# EAGLE design 2te4In_ak_01_SNT (EAGLE 5.00)
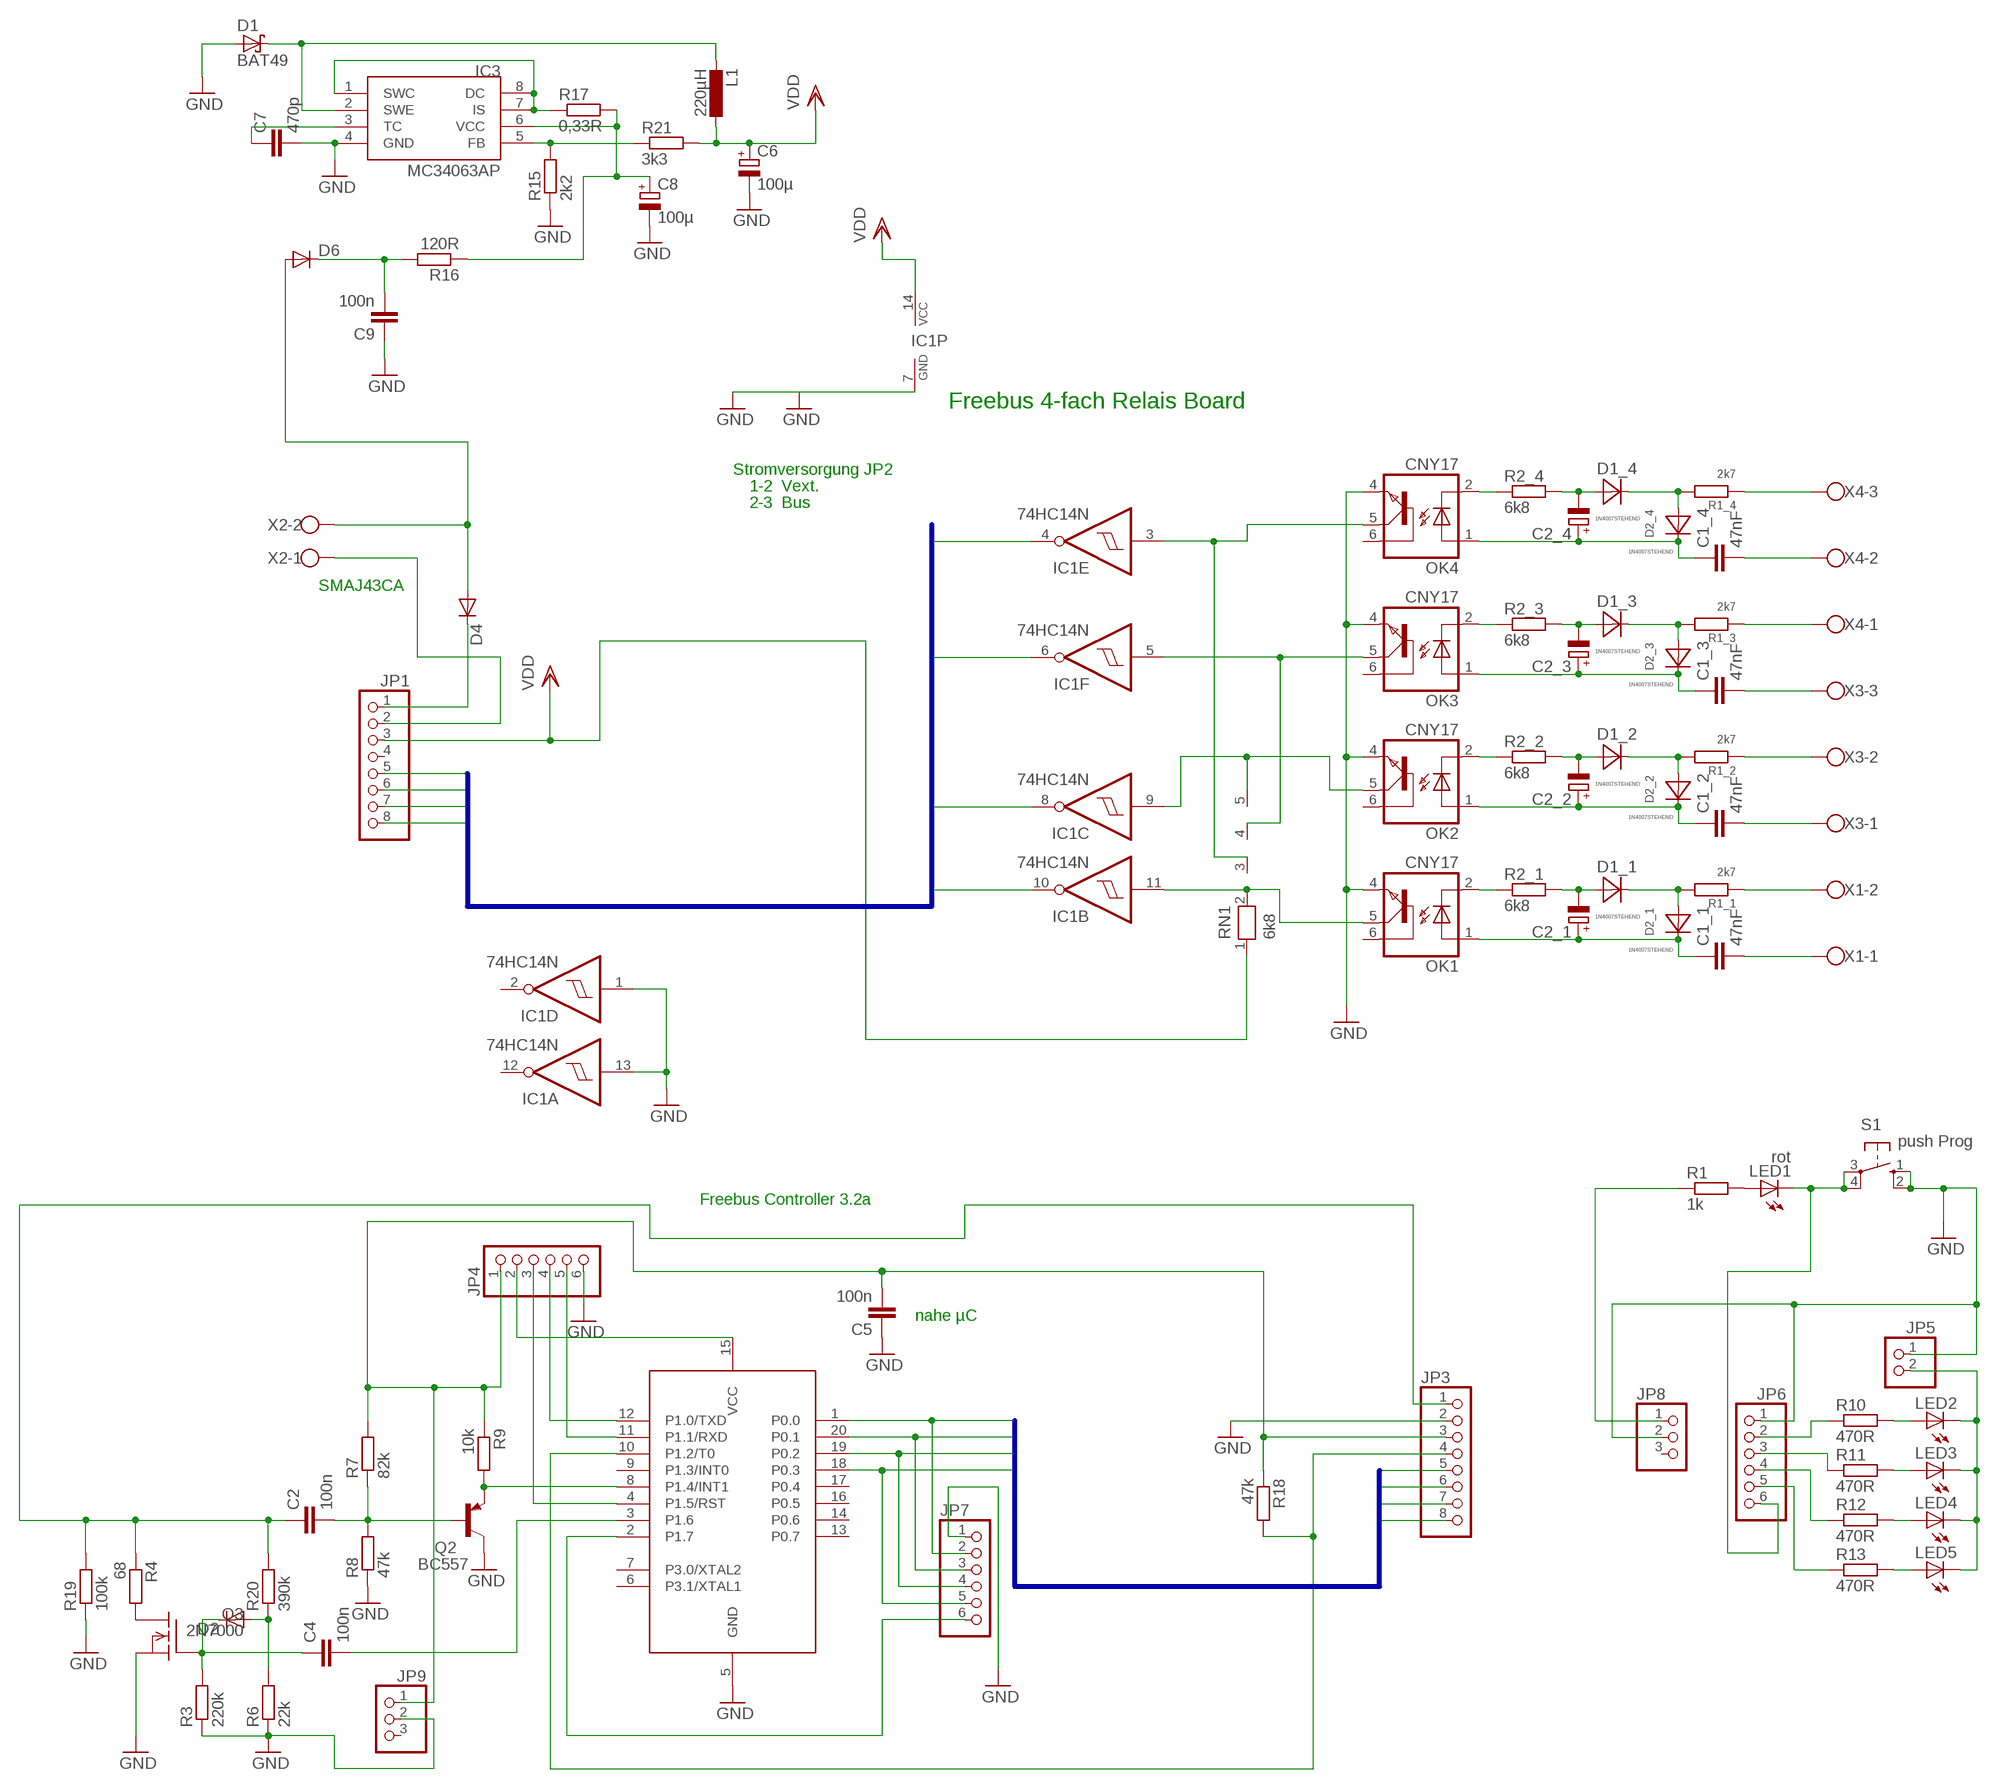
[diagram p0: schematic, sheet 1]

## Parts
C1_1  47nF  C-EU075-063X106  [C075-063X106]
C1_2  47nF  C-EU075-063X106  [C075-063X106]
C1_3  47nF  C-EU075-063X106  [C075-063X106]
C1_4  47nF  C-EU075-063X106  [C075-063X106]
C2  100n  C-EU050-024X044  [C050-024X044]
C2_1  CPOL-EUE2-4  [E2-4]
C2_2  CPOL-EUE2-4  [E2-4]
C2_3  CPOL-EUE2-4  [E2-4]
C2_4  CPOL-EUE2-4  [E2-4]
C4  100n  C-EU050-024X044  [C050-024X044]
C5  100n  C-EU050-024X044  [C050-024X044]
C6  100µ  CPOL-EUE5-8.5  [E5-8,5]
C7  470p  C-EU025-024X044  [C025-024X044]
C8  100µ  CPOL-EUE5-8.5  [E5-8,5]
C9  100n  C-EU050-024X044  [C050-024X044]
D1  BAT49  [DO41-10]
D1_1  1N4007STEHEND  [RAD2,5]
D1_2  1N4007STEHEND  [RAD2,5]
D1_3  1N4007STEHEND  [RAD2,5]
D1_4  1N4007STEHEND  [RAD2,5]
D2  1N41481N4148S  [D-2.5]
D2_1  1N4007STEHEND  [RAD2,5]
D2_2  1N4007STEHEND  [RAD2,5]
D2_3  1N4007STEHEND  [RAD2,5]
D2_4  1N4007STEHEND  [RAD2,5]
D4  1N41481N4148S  [D-2.5]
D6  1N41481N4148S  [D-2.5]
IC1  74HC14N  [DIL14]
IC3  MC34063AP  [DIL08]
JP1  PINHD-1X8  [1X08]
JP3  PINHD-1X8  [1X08]
JP4  PINHD-1X6  [1X06]
JP5  PINHD-1X2  [1X02]
JP6  PINHD-1X6  [1X06]
JP7  PINHD-1X6  [1X06]
JP8  PINHD-1X3  [1X03]
JP9  PINHD-1X3  [1X03]
L1  220µH  L-EU0207/5V  [0207/5V]
LED1  rot  LED3MM  [LED3MM]
LED2  LED3MM  [LED3MM]
LED3  LED3MM  [LED3MM]
LED4  LED3MM  [LED3MM]
LED5  LED3MM  [LED3MM]
OK1  CNY17  [DIL06]
OK2  CNY17  [DIL06]
OK3  CNY17  [DIL06]
OK4  CNY17  [DIL06]
Q2  BC557  [TO92]
Q3  2N7000  VN2222KM  [TO237]
R1  1k  R-EU_0207/10  [0207/10]
R1_1  2k7  R-EU_0207/2V  [0207/2V]
R1_2  2k7  R-EU_0207/2V  [0207/2V]
R1_3  2k7  R-EU_0207/2V  [0207/2V]
R1_4  2k7  R-EU_0207/2V  [0207/2V]
R2_1  6k8  R-EU_0207/2V  [0207/2V]
R2_2  6k8  R-EU_0207/2V  [0207/2V]
R2_3  6k8  R-EU_0207/2V  [0207/2V]
R2_4  6k8  R-EU_0207/2V  [0207/2V]
R3  220k  R-EU_0204/7  [0204/7]
R4  68  R-EU_0207/10  [0207/10]
R6  22k  R-EU_0207/10  [0207/10]
R7  82k  R-EU_0207/10  [0207/10]
R8  47k  R-EU_0207/10  [0207/10]
R9  10k  R-EU_0207/10  [0207/10]
R10  470R  R-EU_0207/10  [0207/10]
R11  470R  R-EU_0207/10  [0207/10]
R12  470R  R-EU_0207/10  [0207/10]
R13  470R  R-EU_0207/10  [0207/10]
R15  2k2  R-EU_0207/2V  [0207/2V]
R16  120R  R-EU_0207/2V  [0207/2V]
R17  0,33R  R-EU_0207/2V  [0207/2V]
R18  47k  R-EU_0207/10  [0207/10]
R19  100k  R-EU_0207/10  [0207/10]
R20  390k  R-EU_0207/10  [0207/10]
R21  3k3  R-EU_0207/2V  [0207/2V]
RN1  6k8  RN04  [RN-5]
S1  push Prog  10-XX  [B3F-10XX]
U1  89LPC922  [DIL20]
X1  W237-02P  [W237-132]
X2  W237-02P  [W237-132]
X3  W237-3E  [W237-3E]
X4  W237-3E  [W237-3E]

## Nets
230+_1: C1_1.1 C2_1.+ D2_1.C OK1.1(A)
230+_2: C1_2.1 C2_2.+ D2_2.C OK2.1(A)
230+_3: C1_3.1 C2_3.+ D2_3.C OK3.1(A)
230+_4: C1_4.1 C2_4.+ D2_4.C OK4.1(A)
230-_1: C2_1.- D1_1.A R2_1.2
230-_2: C2_2.- D1_2.A R2_2.2
230-_3: C2_3.- D1_3.A R2_3.2
230-_4: C2_4.- D1_4.A R2_4.2
230N_1: D1_1.C D2_1.A R1_1.2
230N_2: D1_2.C D2_2.A R1_2.2
230N_3: D1_3.C D2_3.A R1_3.2
230N_4: D1_4.C D2_4.A R1_4.2
GND: C5.1 C6.- C7.2 C8.- C9.1 D1.A IC1.1(D:I) IC1.7(P:GND) IC1.13(A:I) IC3.4(GND) JP1.2 JP3.2 JP4.6 JP5.1 JP6.1 JP7.1 JP8.2 JP9.2 OK1.4(EMI) OK2.4(EMI) OK3.4(EMI) OK4.4(EMI) Q2.3(C) Q3.3(S) R3.1 R6.1 R8.1 R15.1 R19.1 S1.1(S) S1.2(S1) U1.5(GND) X2.1
IO1: IC1.10(B:O) JP1.5
IO2: IC1.8(C:O) JP1.8
IO3: IC1.6(F:O) JP1.7
IO4: IC1.4(E:O) JP1.6
N$1: C1_1.2 X1.1
N$2: R1_1.1 X1.2
N$3: Q2.1(E) R9.2 U1.8(P1.4/INT1)
N$4: D4.A D6.A X2.2
N$5: C1_2.2 X3.1
N$6: R1_2.1 X3.2
N$7: C1_3.2 X3.3
N$8: R1_3.1 X4.1
N$9: C1_4.2 X4.2
N$10: R1_4.1 X4.3
N$11: LED2.A R10.2
N$12: LED3.A R11.2
N$13: C2.2 Q2.2(B) R7.1 R8.2
N$14: C4.2 U1.3(P1.6)
N$15: Q3.1(D) R4.2
N$16: IC3.5(FB) R15.2 R21.1
N$17: IC1.11(B:I) OK1.5(COL) RN1.2
N$18: C2.1 JP3.1 R4.1 R19.2 R20.2
N$19: IC1.9(C:I) OK2.5(COL) RN1.5
N$20: JP5.2 LED2.K(C) LED3.K(C) LED4.K(C) LED5.K(C)
N$21: C5.2 JP3.3 JP4.1 JP9.1 R7.2 R9.1 R18.1
N$22: JP6.6 LED1.K(C) S1.3(P) S1.4(P1)
N$23: LED4.A R12.2
N$24: LED5.A R13.2
N$25: JP4.3 U1.4(P1.5/RST)
N$26: JP4.2 U1.15(VCC)
N$27: C4.1 D2.C Q3.2(G) R3.2
N$28: LED1.A R1.2
N$29: JP4.4 U1.12(P1.0/TXD)
N$30: JP4.5 U1.11(P1.1/RXD)
N$31: IC1.5(F:I) OK3.5(COL) RN1.4
N$34: JP6.2 R10.1
N$35: JP6.3 R11.1
N$36: JP6.4 R12.1
N$37: IC1.3(E:I) OK4.5(COL) RN1.3
N$38: JP6.5 R13.1
N$39: JP8.1 R1.1
N$40: D4.C JP1.1
N$43: JP3.4 R18.2 U1.10(P1.2/T0)
N$44: D2.A R6.2 R20.1
N$45: IC3.1(SWC) IC3.7(IS) IC3.8(DC) R17.1
N$46: D1.C IC3.2(SWE) L1.2
N$47: C7.1 IC3.3(TC)
N$49: C9.2 D6.C R16.2
N$50: C8.+ IC3.6(VCC) R16.1 R17.2
OPT_1: OK1.2(C) R2_1.1
OPT_2: OK2.2(C) R2_2.1
OPT_3: OK3.2(C) R2_3.1
OPT_4: OK4.2(C) R2_4.1
P0.0: JP3.5 JP7.2 U1.1(P0.0)
P0.1: JP3.8 JP7.3 U1.20(P0.1)
P0.2: JP3.7 JP7.4 U1.19(P0.2)
P0.3: JP3.6 JP7.5 U1.18(P0.3)
PGM: JP7.6 U1.2(P1.7)
VDD: C6.+ IC1.14(P:VCC) JP1.3 L1.1 R21.2 RN1.1
Unconnected: IC1.2(D:O) IC1.12(A:O) JP1.4 JP8.3 JP9.3 OK1.6(BAS) OK2.6(BAS) OK3.6(BAS) OK4.6(BAS) U1.6(P3.1/XTAL1) U1.7(P3.0/XTAL2) U1.9(P1.3/INT0) U1.13(P0.7) U1.14(P0.6) U1.16(P0.5) U1.17(P0.4)

## Buses
IO[1..8]
P0.[0..7]

## Notes on the sheet
- Freebus 4-fach Relais Board
- Stromversorgung JP2
- 1-2  Vext.
- 2-3  Bus
- SMAJ43CA
- Freebus Controller 3.2a
- nahe µC

## Library data of the parts
C1_1-C1_4 C2 C4 C5 C7 C9 = rcl:C-EU: CAPACITOR, European symbol
C2_1-C2_4 C6 C8 = rcl:CPOL-EU: POLARIZED CAPACITOR, European symbol
D1 = diode:BAT49: DIODE small signal diode
D1_1-D1_4 D2_1-D2_4 = diode:1N4007
D2 D4 D6 = diode:1N4148: DIODE high speed (Philips)
IC1 = 74xx-eu:74*14: Hex schmitt trigger INVERTER
IC3 = mc34063:MC34063
JP1 JP3 = pinhead:PINHD-1X8: PIN HEADER
JP4 JP6 JP7 = pinhead:PINHD-1X6: PIN HEADER
JP5 = pinhead:PINHD-1X2: PIN HEADER
JP8 JP9 = pinhead:PINHD-1X3: PIN HEADER
L1 = rcl:L-EU: INDUCTOR, European symbol
LED1-LED5 = led:LED: LED OSRAM: - CHIPLED LG R971, LG N971, LY N971, LG Q971, LY Q971, LO R971, LY R971 LH N974, LH R974 LS Q976, LO Q976, LY Q976 LO Q996 - Hyper CHIPLED LW Q18S LB Q993, LB Q99A, LB R99A - SideLED LS A670, LO A670, LY A670, LG A670, LP A670 LB A673, LV A673, LT A673, LW A673 LH A674 LY A675 LS A676, LA A676, LO A676, LY A676, LW A676 LS A679, LY A679, LG A679 - Hyper Micro SIDELED® LS Y876, LA Y876, LO Y876, LY Y876 LT Y87S - SmartLED LW L88C, LW L88S LB L89C, LB L89S, LG L890 LS L89K, LO L89K, LY L89K LS L896, LA L896, LO L896, LY L896 - TOPLED LS T670, LO T670, LY T670, LG T670, LP T670 LSG T670, LSP T670, LSY T670, LOP T670, LYG T670 LG T671, LOG T671, LSG T671 LB T673, LV T673, LT T673, LW T673 LH T674 LS T676, LA T676, LO T676, LY T676, LB T676, LH T676, LSB T676, LW T676 LB T67C, LV T67C, LT T67C, LS T67K, LO T67K, LY T67K, LW E67C LS E67B, LA E67B, LO E67B, LY E67B, LB E67C, LV E67C, LT E67C LW T67C LS T679, LY T679, LG T679 LS T770, LO T770, LY T770, LG T770, LP T770 LB T773, LV T773, LT T773, LW T773 LH T774 LS E675, LA E675, LY E675, LS T675 LS T776, LA T776, LO T776, LY T776, LB T776 LHGB T686 LT T68C, LB T68C - Hyper Mini TOPLED® LB M676 - Mini TOPLED Santana® LG M470 LS M47K, LO M47K, LY M47K Source: http://www.osram.convergy.de - LUMILED® LXK2-PW12-R00, LXK2-PW12-S00, LXK2-PW14-U00, LXK2-PW14-V00 LXK2-PM12-R00, LXK2-PM12-S00, LXK2-PM14-U00 LXK2-PE12-Q00, LXK2-PE12-R00, LXK2-PE12-S00, LXK2-PE14-T00, LXK2-PE14-U00 LXK2-PB12-K00, LXK2-PB12-L00, LXK2-PB12-M00, LXK2-PB14-N00, LXK2-PB14-P00, LXK2-PB14-Q00 LXK2-PR12-L00, LXK2-PR12-M00, LXK2-PR14-Q00, LXK2-PR14-R00 LXK2-PD12-Q00, LXK2-PD12-R00, LXK2-PD12-S00 LXK2-PH12-R00, LXK2-PH12-S00 LXK2-PL12-P00, LXK2-PL12-Q00, LXK2-PL12-R00 Source: www.luxeon.com
OK1-OK4 = optocoupler:CNY17: SIEMENS OPTO COUPLER
Q2 = transistor-pnp:BC557: PNP Transistor
Q3 = transistor-fet:VN2222KM: N-Channel Enhancement MOSFET (VMOS); 60V; 0,5A; 7,5Ohm
R1 R1_1-R1_4 R2_1-R2_4 R3 R4 R6-R13 R15-R21 = rcl:R-EU_: RESISTOR, European symbol
RN1 = resistor-net:RN04: RESISTOR NETWORK
S1 = switch-omron:10-XX: OMRON SWITCH
U1 = micro-philips:89LPC922
X1 X2 = con-wago-508:W237-02P: WAGO SREW CLAMP
X3 X4 = con-wago-508:W237-3E: WAGO SREW CLAMP

## Board
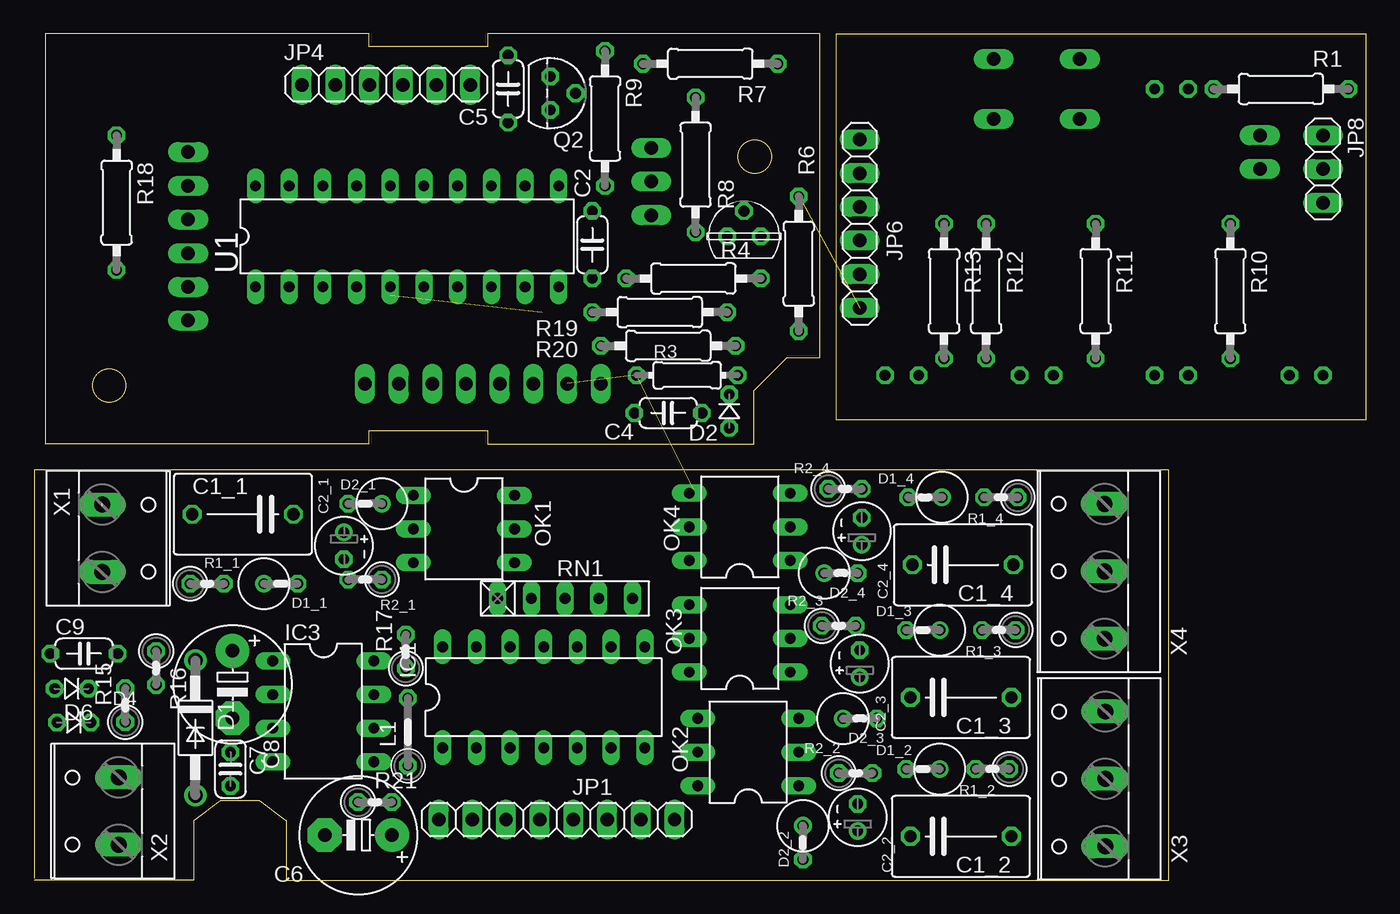
[diagram p1: board, top side]
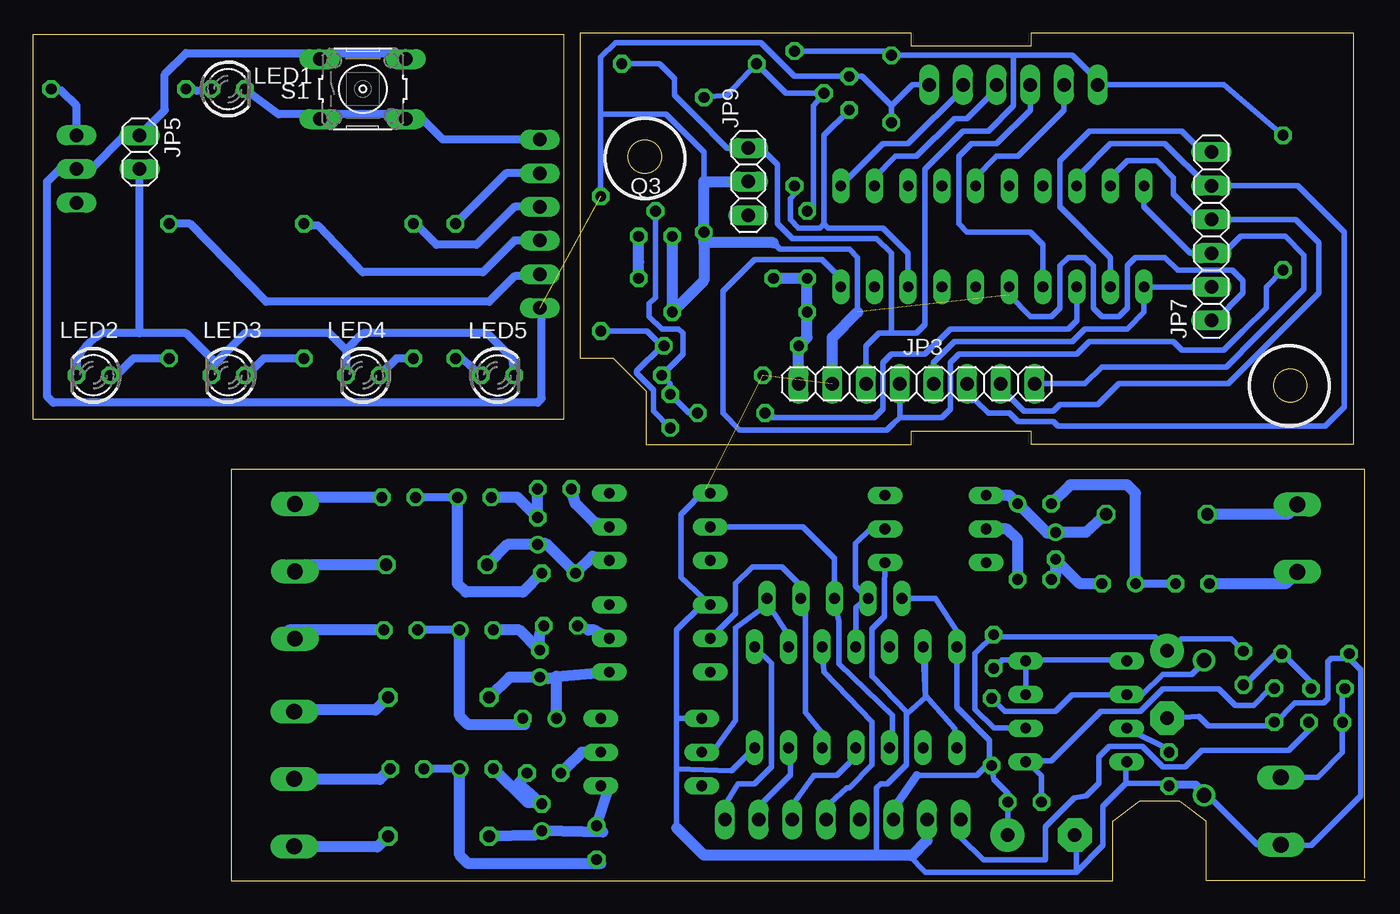
[diagram p2: board, bottom side, seen from below]

Size 100.42 x 63.9 mm. Coordinates in mm from the lower left corner, seen from the top.
Outline: 0.01,0.16 0.01,31 85.5,31 85.5,0 19,0 19,4.5 18.99,4.51 16.99,6.01 14.01,6.01 14.01,6 12,4.49 12,0 0,0
Outline: 59.2,39.4 56.7,39.4 54.2,36.9
Outline: 54.2,36.9 54.2,32.9 34.2,32.9 34.2,33.9
Outline: 34.2,33.9 25.2,33.9 25.2,32.9 0.83,32.9 0.83,63.9 25.2,63.9 25.2,62.9 34.2,62.9 34.2,63.9
Outline: 34.2,63.9 59.2,63.9 59.2,39.4
Outline: 100.42,34.78 100.42,63.82
Outline: 100.42,63.83 60.42,63.83
Outline: 60.42,63.82 60.42,34.78
Outline: 60.42,34.78 100.42,34.78
Outline: circle at 54.32,54.58 radius 1.26
Outline: circle at 5.65,37.32 radius 1.26
Copper layers (1*16): Top 0.035mm / dielectric 1.5mm / Bottom 0.035mm
Design rules "default": minimum track width 10mil, minimum drill 24mil, track to track 8mil, track to pad 8mil, pad to pad 8mil, via to via 8mil, smd to smd 8mil, copper to edge 40mil, drill to drill 8mil, minimum pad ring 10mil, minimum via ring 8mil, stop-mask expansion 4mil, vias tented up to drill 0mil, thermal gap 10mil

### Footprints (pad centres in the part's own frame; a part is rotated, then mirrored left to right if it is on the bottom)
C075-063X106 = drill 0.914 octagon: 1 -3.81,0; 2 3.81,0
C050-024X044 = drill 0.813 octagon: 1 -2.54,0; 2 2.54,0
E2-4 = drill 0.813 pad 1.27 round: + -1.016,0 | drill 0.813 pad 1.27 octagon: - 1.016,0
E5-8,5 = drill 1.016 pad 2.54 round: + -2.54,0 | drill 1.016 pad 2.54 octagon: - 2.54,0
C025-024X044 = drill 0.813 octagon: 1 -1.27,0; 2 1.27,0
DO41-10 = drill 1.118 round: A 5.08,0; C -5.08,0
RAD2,5 = drill 0.813 octagon: A 1.27,0 | drill 0.813 round: C -1.27,0
D-2.5 = drill 0.813 octagon: A 1.27,0; C -1.27,0
DIL14 = drill 0.813 long: 1 -7.62,-3.81; 2 -5.08,-3.81; 3 -2.54,-3.81; 4 0,-3.81; 5 2.54,-3.81; 6 5.08,-3.81; 7 7.62,-3.81; 8 7.62,3.81; 9 5.08,3.81; 10 2.54,3.81; 11 0,3.81; 12 -2.54,3.81; 13 -5.08,3.81; 14 -7.62,3.81
DIL08 = drill 0.813 long: 1 -3.81,-3.81; 2 -1.27,-3.81; 3 1.27,-3.81; 4 3.81,-3.81; 5 3.81,3.81; 6 1.27,3.81; 7 -1.27,3.81; 8 -3.81,3.81
1X08 = drill 1.016 long: 1 -8.89,0; 2 -6.35,0; 3 -3.81,0; 4 -1.27,0; 5 1.27,0; 6 3.81,0; 7 6.35,0; 8 8.89,0
1X06 = drill 1.016 long: 1 -6.35,0; 2 -3.81,0; 3 -1.27,0; 4 1.27,0; 5 3.81,0; 6 6.35,0
1X02 = drill 1.016 long: 1 -1.27,0; 2 1.27,0
1X03 = drill 1.016 long: 1 -2.54,0; 2 0,0; 3 2.54,0
0207/5V = drill 0.813 octagon: 1 -2.54,0; 2 2.54,0
LED3MM = drill 0.813 octagon: A -1.27,0; K 1.27,0
DIL06 = drill 0.813 long: 1 -2.54,-3.81; 2 0,-3.81; 3 2.54,-3.81; 4 2.54,3.81; 5 0,3.81; 6 -2.54,3.81
TO92 = drill 0.813 octagon: 1 1.27,0; 2 0,1.905; 3 -1.27,0
TO237 = drill 0.813 octagon: 1 1.27,0; 2 0,1.905; 3 -1.27,0
0207/10 = drill 0.813 octagon: 1 -5.08,0; 2 5.08,0
0207/2V = drill 0.813 octagon: 1 -1.27,0; 2 1.27,0
0204/7 = drill 0.813 octagon: 1 -3.81,0; 2 3.81,0
RN-5 = drill 0.813 long: 1 -5.08,0; 2 -2.54,0; 3 0,0; 4 2.54,0; 5 5.08,0
B3F-10XX = drill 1.016 long: 1 -3.251,2.261; 2 3.251,2.261; 3 -3.251,-2.261; 4 3.251,-2.261
DIL20 = drill 0.813 long: 1 -11.43,-3.81; 2 -8.89,-3.81; 3 -6.35,-3.81; 4 -3.81,-3.81; 5 -1.27,-3.81; 6 1.27,-3.81; 7 3.81,-3.81; 8 6.35,-3.81; 9 8.89,-3.81; 10 11.43,-3.81; 11 11.43,3.81; 12 8.89,3.81; 13 6.35,3.81; 14 3.81,3.81; 15 1.27,3.81; 16 -1.27,3.81; 17 -3.81,3.81; 18 -6.35,3.81; 19 -8.89,3.81; 20 -11.43,3.81
W237-132 = drill 1.194 long: 1 -2.54,-0.635; 2 2.54,-0.635
W237-3E = drill 1.194 long: 1 -5.08,-0.635; 2 0,-0.635; 3 5.08,-0.635

### Placement (x,y rotation side)
C1_1  15.72,27.62 180 top
C1_2  69.85,3.34 0 top
C1_3  69.85,13.81 0 top
C1_4  70.01,23.81 0 top
C2  42.07,47.94 90 top
C2_1  23.34,25.24 270 top
C2_2  62.07,4.76 90 top
C2_3  62.23,16.35 90 top
C2_4  62.39,26.35 90 top
C4  47.78,35.26 180 top
C5  35.72,59.69 90 top
C6  24.42,3.42 180 top
C7  14.78,8.4 270 top
C8  14.93,14.78 270 top
C9  3.73,17.12 0 top
D1  12.13,11.51 270 top
D1_1  18.57,22.39 0 top
D1_2  66.99,8.42 180 top
D1_3  66.99,18.89 180 top
D1_4  67.15,28.89 180 top
D2  52.39,35.4 270 top
D2_1  24.92,28.42 180 top
D2_2  57.94,2.86 270 top
D2_3  62.23,12.23 0 top
D2_4  60.8,23.18 0 top
D4  2.97,11.92 180 top
D6  2.8,14.47 180 top
IC1  38.4,13.82 0 top
IC3  21.78,12.76 270 top
JP1  39.37,4.61 0 top
JP3  33.81,37.47 0 bottom
JP4  26.51,60.01 0 top
JP5  92.39,54.93 270 bottom
JP6  62.23,49.53 90 top
JP7  11.59,48.58 90 bottom
JP8  97.15,53.66 270 top
JP9  46.51,52.71 270 bottom
L1  28.16,11.2 90 top
LED1  85.72,59.69 0 bottom
LED2  95.88,38.1 180 bottom
LED3  85.72,38.1 180 bottom
LED4  75.56,38.1 180 bottom
LED5  65.4,38.1 0 bottom
OK1  32.38,26.51 270 top
OK2  53.82,9.69 90 top
OK3  53.18,18.26 90 top
OK4  53.18,26.67 90 top
Q2  38.89,59.37 270 top
Q3  53.5,48.58 0 top
R1  93.98,59.69 180 top
R1_1  13.02,22.39 0 top
R1_2  72.23,8.42 180 top
R1_3  72.71,18.89 180 top
R1_4  72.87,28.89 180 top
R2_1  24.92,22.7 180 top
R2_2  61.91,8.1 0 top
R2_3  60.64,19.21 0 top
R2_4  61.12,29.53 0 top
R3  49.21,38.1 0 top
R4  49.69,45.4 0 top
R6  57.63,46.52 270 top
R7  50.96,61.6 0 top
R8  49.85,53.98 90 top
R9  43.02,57.47 270 top
R10  90.17,44.45 270 top
R11  80.01,44.45 270 top
R12  71.75,44.45 270 top
R13  68.58,44.45 270 top
R15  6.84,13.23 90 top
R16  9.18,16.03 270 top
R17  28,17.27 90 top
R18  6.19,51.12 270 top
R19  47.15,42.86 180 top
R20  47.78,40.32 180 top
R21  25.67,5.91 0 top
RN1  40,21.27 0 top
S1  75.56,59.69 0 bottom
U1  28.1,48.58 0 top
X1  5.74,25.81 270 top
X2  5.71,5.24 90 top
X3  80.1,7.66 90 top
X4  80.05,23.32 90 top

### Tracks (layer width: path | path; a pad name or v marks a point on that pad's centre or on a via)
230+_1
  Bottom 0.813: OK1.1 26.83,29.05 D2_1.C 23.97,26.2 23.33,26.2 C2_1.+ 21.05,26.26 C1_1.1
230+_2
  Bottom 0.813: OK2.1 56.99,6.99 D2_2.C 57.47,3.65 C2_2.+ 62.61,3.43 C1_2.1
230+_3
  Bottom 0.813: OK3.1 60.96,15.4 D2_3.C 60.96,15.24 61.59,15.24 C2_3.+ 64.52,15.34 C1_3.1
230+_4
  Bottom 0.813: OK4.1 58.26,24.45 D2_4.C 61.75,25.4 62.39,25.4 C2_4.+ 64.67,25.34 C1_4.1
230-_1
  Bottom 0.813: C2_1.- 23.33,24.29 | R2_1.2 23.33,23.02 C2_1.- | C2_1.- 21.49,22.39 D1_1.A
230-_2
  Bottom 0.813: C2_2.- 62.71,6.19 | R2_2.2 63.82,7.3 C2_2.- | C2_2.- 63.12,5.88 D1_2.A
230-_3
  Bottom 0.813: C2_3.- 62.23,17.31 | R2_3.2 62.23,18.58 C2_3.- | C2_3.- 63.75,18.89 D1_3.A
230-_4
  Bottom 0.813: C2_4.- 62.39,27.31 | C2_4.- R2_4.2 | C2_4.- 63.91,28.89 D1_4.A
230N_1
  Bottom 0.61: R1_1.2 D1_1.C
  Bottom 0.813: D1_1.C 17.3,29.21 17.94,29.85 22.22,29.85 D2_1.A
230N_2
  Bottom 0.61: D1_2.C R1_2.2
  Bottom 0.813: D1_2.C 68.26,1.91 67.63,1.27 57.62,1.27 D2_2.A
230N_3
  Bottom 0.61: D1_3.C R1_3.2
  Bottom 0.813: D1_3.C 68.26,12.38 67.63,11.75 63.34,11.75 D2_3.A
230N_4
  Bottom 0.61: D1_4.C R1_4.2
  Bottom 0.813: D1_4.C 68.42,22.39 67.78,21.75 63.5,21.75 D2_4.A
GND  (4 unrouted)
  Bottom 0.406: 35.72,58.42 37.94,60.64 Q2.3 43.02,60.64 45.56,63.18 56.51,63.18 57.62,62.07 57.62,57.79 | R6.1 57.62,57.95 57.62,57.79 | 57.62,57.79 52.7,57.79 50.96,56.04 49.85,54.93 R8.1 | U1.5 26.83,44.13 25.24,42.55 23.65,42.55 23.02,43.18 23.02,46.36 22.38,46.99 21.11,46.99 20.48,46.36 20.48,43.18 19.84,42.55 18.57,42.55 17.94,43.18 17.94,46.36 17.3,46.99 15.08,46.99 14.13,46.04 10,46.04 9.21,45.25 9.21,44.29 11.27,42.23 JP7.1 | 35.72,58.42 C5.1 | 35.72,58.42 34.13,60.01 JP4.6 | 38.26,42.86 38.26,46.99 38.89,47.63 44.13,47.63 44.61,48.1 | IC1.1 30.93,11.44 33.16,13.98 33.16,17.94 | 33.16,17.94 | 33.16,17.94 IC1.13 33.16,13.82 34.51,12.63 | 34.51,12.63 34.59,12.55 34.59,8.74 36.02,7.31 36.5,7.31 36.83,6.97 36.83,1.91 | OK1.4 36.19,24.29 36.25,21.47 36.25,19.92 37.18,18.98 37.18,15.4 37.13,15.4 34.58,12.7 | 34.51,12.63 34.58,12.7 | 34.58,12.7 34.43,12.7 | 51.91,3.97 51.91,8.42 | 51.91,8.42 51.91,12.23 | IC1.7 47.77,8.26 51.91,8.42 | 51.91,12.23 OK2.4 | 51.91,12.23 51.91,18.89 50.01,20.8 OK3.4 51.59,22.86 51.59,27.62 49.69,29.53 OK4.4 | 78.9,62.39 78.85,62.39 S1.1 | 72.35,62.39 S1.2 | 78.9,62.39 | 12.76,7.31 8.14,2.7 X2.1 6.28,2.7 6.22,2.65 4.04,2.65 0.31,6.38 0.31,15.87 1.19,16.75 | 12.76,7.31 18.05,7.31 | 18.05,7.31 19.76,5.6 19.76,2.65 21.78,0.62 | 34.38,1.91 33.14,0.62 21.78,0.62 | 1.19,16.75 C9.1 | 1.19,16.75 2.54,16.75 2.8,16.49 2.8,13.69 3.11,13.38 5.29,13.38 6.84,11.83 R15.1 6.84,11.98 7.16,11.67 11.82,11.67 12.55,12.4 C8.- | 18.05,7.31 18.05,8.71 17.97,8.79 IC3.4 17.89,9.03 | D1.A 12.19,6.43 12.76,7 12.76,7.16 | 12.76,7.31 12.76,7.16 | C7.2 12.78,7.13 12.76,7.16 | C6.- 21.78,3.32 21.78,0.62
  Bottom 0.406: JP5.1
  Bottom 0.61: JP1.2 33.02,5.24 | JP6.1 62.07,42.39 62.07,36.36 62.39,36.04 98.9,36.04 99.38,36.52 99.38,52.71 98.42,53.66 JP8.2 96.04,53.66 93.5,56.2 JP5.1 90.49,58.1 90.49,60.8 88.9,62.39 78.9,62.39 | 78.85,62.39 72.35,62.39
  Bottom 0.813: Q3.3 52.23,48.1 52.23,43.5 R19.1 49.85,45.25 49.85,48.1 | 49.85,48.1 R8.1 49.85,52.71 JP9.2 | JP3.2 40.16,40.96 38.26,42.86 | 44.61,48.1 49.85,48.1 | JP1.2 33.02,3.02 34.13,1.91 34.38,1.91 36.83,1.91 49.85,1.91 51.91,3.97 | JP1.2
IO1
  Bottom 0.406: IC1.10 40.78,15.74 37.18,11.98 37.18,8.71 38.89,7 39.05,7 40.76,5.45 40.76,4.67 40.7,4.61 JP1.5
IO2
  Bottom 0.406: IC1.8 44.75,16.36 44.75,8.58 46.02,7.31 47.29,7.31 48.26,5.72 JP1.8 | JP1.8
IO3
  Bottom 0.406: JP1.7 45.72,4.76 45.72,5.56 43.32,7.96 43.32,10.17 IC1.6
IO4
  Bottom 0.406: IC1.4 38.24,9.52 39.83,7.94 41.54,7.94 43.25,5.6 43.25,4.51 43.18,4.58 JP1.6
N$1
  Bottom 0.813: X1.1 5.83,27.62 C1_1.2
N$2
  Bottom 0.813: X1.2 5.99,22.39 R1_1.1
N$3
  Bottom 0.406: U1.8 34.45,47.31 36.35,49.21 40.48,49.21 40.8,49.53 | R9.2 43.02,51.75 43.34,51.44 43.34,49.85 42.7,49.21 41.12,49.21 40.8,49.53 | 40.8,49.53 40.8,56.2 Q2.1
N$4
  Bottom 0.406: X2.2 6.38,7.78 3.58,7.78 1.7,9.66 D4.A 1.7,14.32 1.56,14.47 D6.A
N$5
  Bottom 0.406: 81.25,2.54 arc-90 X3.1
  Bottom 0.813: 81.25,2.54 81.28,2.54 | 81.25,2.54 X3.1 | C1_2.2 74.45,2.54 81.25,2.54
N$6
  Bottom 0.406: 81.17,7.62 arc90 X3.2
  Bottom 0.813: X3.2 81.17,7.62 74.29,7.62 R1_2.1
N$7
  Bottom 0.406: 81.28,12.86 81.28,12.81 arc-90 X3.3
  Bottom 0.813: 81.28,12.86 74.61,12.86 C1_3.2
N$8
  Bottom 0.813: X4.1 81.12,18.24 81.12,18.89 R1_3.1
N$9
  Bottom 0.406: 81.12,23.18 81.12,23.32 X4.2
  Bottom 0.813: C1_4.2 81.12,23.81 81.12,23.32
N$10
  Bottom 0.406: 81.12,28.4 X4.3
  Bottom 0.813: R1_4.1 81.12,28.89 81.12,28.4
N$11
  Bottom 0.61: LED2.A 94.14,38.1 92.87,39.37 R10.2
N$12
  Bottom 0.61: LED3.A 84.3,38.1 83.02,39.37 R11.2
N$13
  Bottom 0.406: C2.2 41.59,50.8 41.59,58.42 Q2.2 43.66,59.37 R7.1 48.1,59.22 R8.2
N$14
  Bottom 0.406: C4.2 45.24,34.93 36.99,34.93 36.35,35.56 36.35,39.05 35.72,39.69 33.18,39.69 31.27,41.59 22.38,41.59 21.75,42.23 U1.3
N$15
  Bottom 0.813: Q3.1 54.77,46.67 R4.2
N$16
  Bottom 0.406: R15.2 7.13,14.5 8.4,13.23 9.8,13.23 11.04,14.47 15.25,14.47 16.96,12.76 19.91,12.76 23.65,9.03 25.36,9.03 25.51,8.87 IC3.5 25.51,9.03 24.4,7.91 R21.1
N$17
  Bottom 0.406: IC1.11 38.4,20.59 37.62,21.27 RN1.2 38.42,22.23 38.42,25.4 37.3,26.51 OK1.5 36.19,26.83
N$18
  Bottom 0.813: R4.1 C2.1 R19.2 42.07,40.96 R20.2 JP3.1
N$19
  Bottom 0.406: 45.08,20.96 43.32,18.26 IC1.9 43.32,17.79 | RN1.5 | RN1.5 | OK2.5 49.21,9.69 47.45,12.07 47.45,19.05 45.08,20.8 45.08,20.96 | RN1.5 | RN1.5 | 45.08,20.96 RN1.5
N$20
  Bottom 0.61: LED5.K 64.29,39.37 66.2,41.28 75.56,41.28 76.83,40.01 | 76.83,40.01 LED4.K | LED3.K 86.83,38.9 86.68,39.05 | 86.68,39.05 84.45,41.28 78.1,41.28 76.83,40.01 | 76.83,40.01 | LED2.K 97.15,39.37 arc23 95.25,41.28 92.39,41.28 | 92.39,41.28 88.9,41.28 86.68,39.05 | 92.39,41.28 JP5.2
N$21
  Bottom 0.406: R18.1 10.63,60.01 JP4.1 20.16,60.33 22.06,62.23 26.51,62.23 | 35.72,41.28 36.67,41.28 37.62,40.32 JP3.3 | 26.51,62.23 C5.2 36.04,62.55 R9.1 | 26.51,62.23 26.51,58.42 28.41,56.52 30.32,56.52 33.18,53.66 33.18,41.91 33.81,41.28 35.72,41.28 | R7.2 53.18,61.6 52.07,60.49 52.07,59.22 50.48,57.63 48.1,55.25 JP9.1 45.56,55.25 44.29,53.98 44.29,49.53 43.18,48.42 36.83,48.42 35.72,47.31 35.72,41.28
N$22
  Bottom 0.406: 78.9,57.79 78.9,57.83 S1.3 78.69,57.79 | 72.39,57.79 72.39,57.95 72.35,57.95 S1.4 72.39,57.83 72.39,57.79 | 71.44,57.79 72.39,57.79
  Bottom 0.61: LED1.K 81.89,57.79 78.9,57.79 | 72.39,57.79 78.69,57.79 | JP6.6 69.53,55.88 71.44,57.79
N$23
  Bottom 0.61: R12.2 73.02,39.37 LED4.A
N$24
  Bottom 0.61: 66.83,38.1 LED5.A 68.1,39.37 R13.2
N$25
  Bottom 0.406: JP4.3 25.24,58.1 27.78,55.56 29.68,55.56 30.64,54.61 30.64,49.53 30,48.9 25.24,48.9 24.29,47.94 U1.4
N$26
  Bottom 0.406: U1.15 29.37,53.02 27.78,54.61 26.19,54.61 22.7,58.1 JP4.2
N$27
  Bottom 0.406: Q3.2 53.5,43.98 53.97,43.5 53.97,42.55 53.02,41.6 51.75,41.6 51.43,41.28 51.43,39.69 R3.2 52.39,37.47 D2.C 50.97,35.26 C4.1
N$28
  Bottom 0.61: 86.83,59.54 88.08,59.56 R1.2 | LED1.A 86.83,59.54 | 86.83,59.54 86.83,59.53
N$29
  Bottom 0.406: U1.12 36.99,53.02 35.4,54.61 33.81,54.61 30.95,57.47 30,57.47 27.78,59.69 JP4.4
N$30
  Bottom 0.406: U1.11 36.35,55.56 34.45,55.56 30.32,59.69 JP4.5
N$31
  Bottom 0.406: IC1.5 40.78,10.96 42.21,12.7 42.21,20.62 42.54,21.12 | 42.54,21.12 | 42.54,21.12 RN1.4 42.54,22.23 43.97,23.66 46.2,23.66 47.46,22.39 47.46,20.16 OK3.5
N$34
  Bottom 0.406: 62.39,45.56 JP6.2 | 90.33,49.53 R10.1
  Bottom 0.61: 62.39,45.56 64.13,45.56 66.04,43.66 82.87,43.66 88.58,49.53 90.33,49.53
N$35
  Bottom 0.406: 79.53,49.37 R11.1
  Bottom 0.61: JP6.3 64.13,48.26 66.52,45.88 75.56,45.88 78.9,49.37 79.53,49.37
N$36
  Bottom 0.406: 71.44,49.37 R12.1
  Bottom 0.61: JP6.4 64.13,50.8 66.99,47.95 70.01,47.95 71.44,49.37 71.91,49.53
N$37
  Bottom 0.406: RN1.3 40,20.96 39.67,19.53 39.67,16.33 35.63,12.45 35.63,10.27 35.73,10.17 | RN1.3 | RN1.3 40,24.29 42.39,26.67 OK4.5 | 35.73,10.17 35.78,10.12 | IC1.3 35.73,10.17
N$38
  Bottom 0.61: JP6.5 64.77,53.34 R13.1
N$39
  Bottom 0.61: R1.1 98.24,59.56 98.27,59.53 97.15,58.42 JP8.1
N$40
  Bottom 0.406: JP1.1 | D4.C 4.24,11.32 5.75,9.8 12.29,9.8 13.53,8.56 15.25,8.56 16.8,10.11 19.29,10.11 20.07,9.34 20.07,7.31 21,6.38 21.93,6.22 24.11,4.05 24.11,1.56 28.78,1.56 30.49,3.27 30.49,4.36 30.34,4.51 30.43,4.61 JP1.1
  Bottom 0.813: JP1.1 30.48,4.45 30.32,4.45 | JP1.1
N$43
  Bottom 0.406: 6.03,46.04 R18.2 7.46,44.77 7.46,43.18 9.21,41.44 | 9.21,41.44 | 9.21,41.44 10.63,40.01 13.81,40.01 14.45,40.64 20.79,40.64 21.75,39.69 30.64,39.69 31.27,39.05 31.27,35.56 31.91,34.93 35.08,34.93 | 35.08,34.93 JP3.4 | 35.08,34.93 35.56,34.45 36.04,33.97 36.19,33.97 47.15,33.97 48.42,35.24 48.42,44.45 46.04,46.83 44.45,46.83 44.13,46.83 40.96,46.83 39.53,45.4 U1.10
N$44
  Bottom 0.254: R20.1 53.18,40.48
  Bottom 0.406: 53.18,40.48 54.13,41.44 R6.2 | R20.1 53.02,40.32 54.93,38.42 54.93,38.26 53.66,36.99 53.66,35.4 D2.A
N$45
  Bottom 0.406: IC3.7 25.59,14.08 25.67,14.16 25.59,14.24 IC3.8 | IC3.8 25.51,16.64 25.51,16.65 27.36,16.65 R17.1 | 17.89,16.65 | 17.89,16.65 IC3.1 | IC3.8 25.51,16.65 17.89,16.65
N$46
  Bottom 0.406: 23.13,12.97 23.33,12.76 | 23.33,12.76 27.17,12.76 L1.2 | 23.33,12.76 22.09,14 17.89,14 17.91,14.03 IC3.2 16.78,14.03 15.25,15.56 13.07,15.56 12.13,16.49 D1.C
N$47
  Bottom 0.406: IC3.3 17.97,11.44 14.62,9.8 14.78,9.8 14.78,9.65 14.8,9.67 C7.1
N$49
  Bottom 0.406: 6.22,17.11 | 6.22,17.11 C9.2 6.69,17.11 9.18,14.63 R16.2 | D6.C 4.07,14.96 6.22,17.11
N$50
  Bottom 0.406: R16.1 10.09,18.2 13.85,18.2 14.47,17.58 14.93,17.58 C8.+ 15.82,18.36 27.85,18.36 28,18.52 R17.2 29.4,17.14 29.4,12.92 28,11.51 26.6,11.51 25.67,11.52 25.64,11.49 IC3.6
OPT_1
  Bottom 0.813: OK1.2 arc90 28.1,26.35 arc-90 28.26,26.51 26.99,26.51 26.19,25.72 R2_1.1
OPT_2
  Bottom 0.813: OK2.2 59.05,9.69 60.32,8.42 R2_2.1
OPT_3
  Bottom 0.813: OK3.2 58.1,18.89 58.58,18.89 R2_3.1
OPT_4
  Bottom 0.813: OK4.2 58.1,26.99 59.53,28.42 R2_4.1
P0.0
  Bottom 0.406: JP7.2 U1.1 16.67,42.86 17.94,41.59 21.11,41.59 22.06,40.64 30.95,40.64 32.54,39.05 JP3.5
P0.1
  Bottom 0.406: U1.20 16.67,50.8 13.18,47.31 JP7.3 10.63,47.31 9.37,48.58 6.03,48.58 4.6,47.15 4.6,44.61 8.1,41.12 10.48,38.74 19.84,38.74 21.11,37.47 JP3.8
P0.2
  Bottom 0.406: JP3.7 27.46,37.15 25.72,35.4 23.49,35.4 23.02,35.88 20.16,35.88 18.57,37.47 10.32,37.47 6.98,40.8 3.49,44.29 3.49,48.1 5.24,49.85 JP7.4 12.54,49.85 14.45,51.75 14.45,53.02 15.71,54.29 17.94,54.29 19.21,53.02 U1.19
P0.3
  Bottom 0.406: U1.18 21.75,53.02 19.21,55.56 15.08,55.56 11.91,52.39 JP7.5 5.08,52.39 1.59,48.9 1.59,43.34 1.59,35.72 3.02,34.29 23.18,34.29 23.49,34.61 26.19,34.61 26.83,35.24 28.41,35.24 29.37,36.2 30,36.2 JP3.6
PGM
  Bottom 0.406: JP7.6 12.22,54.93 13.81,56.52 20.79,56.52 23.02,54.29 23.02,50.8 19.21,46.99 U1.2
VDD
  Bottom 0.406: RN1.1 32.38,21.27 30.62,18.58 30.62,17.94 | 30.62,17.94 | 30.62,17.94 IC1.14 30.78,13.04 28.31,10.58 28.31,8.87 | JP1.3 35.53,4.61 35.47,4.67 | 28.31,8.87 28.16,8.71 L1.1 28,7.62 26.94,6.56 R21.2 26.94,6.22 26.91,6.22 26.91,3.48 C6.+ | 33.89,7.94 33.91,7.94 | 33.89,7.94 33.84,7.88 | 28.31,8.87 29.25,7.94 33.89,7.94
  Bottom 0.61: 33.8,7.94 33.84,7.88 35.56,5.4 JP1.3
  Bottom 0.813: JP1.3